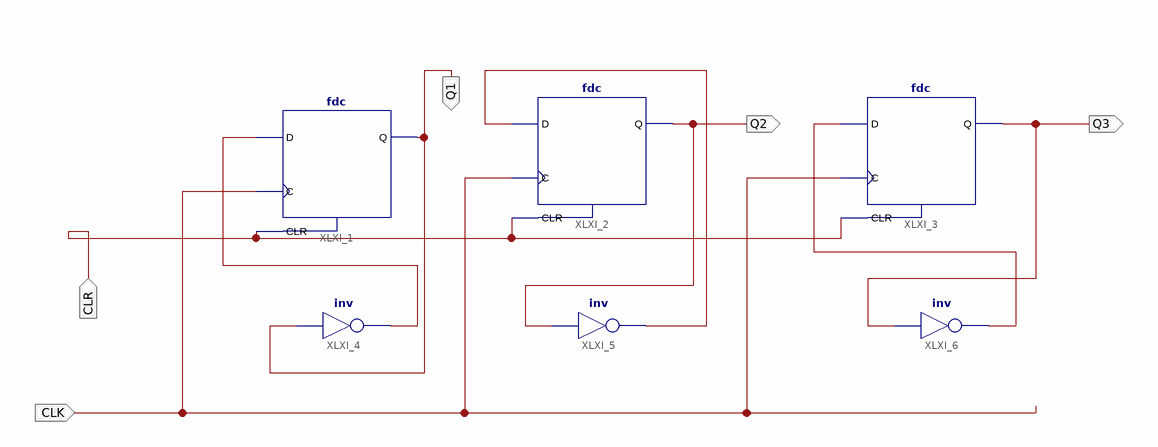
[diagram p0: schematic sheet 1]
// Xilinx ISE schematic counter.sch (virtex4) as structural Verilog: 6 symbols, 5 ports
module counter (
  input  CLR,
  input  CLK,
  output Q3,
  output Q2,
  output Q1
);

  wire XLXN_2, XLXN_6, XLXN_13;

  fdc XLXI_1 (.C(CLK), .CLR(CLR), .D(XLXN_2), .Q(Q1));
  fdc XLXI_2 (.C(CLK), .CLR(CLR), .D(XLXN_6), .Q(Q2));
  fdc XLXI_3 (.C(CLK), .CLR(CLR), .D(XLXN_13), .Q(Q3));
  not XLXI_4 (XLXN_2, Q1);
  not XLXI_5 (XLXN_6, Q2);
  not XLXI_6 (XLXN_13, Q3);
endmodule
